# Altium schematic sheet Sync Demod.SchDoc: Sync Demod
size Tabloid; DocumentNumber: LM-003; Revision: 3.0; SheetNumber: 5; SheetTotal: 11
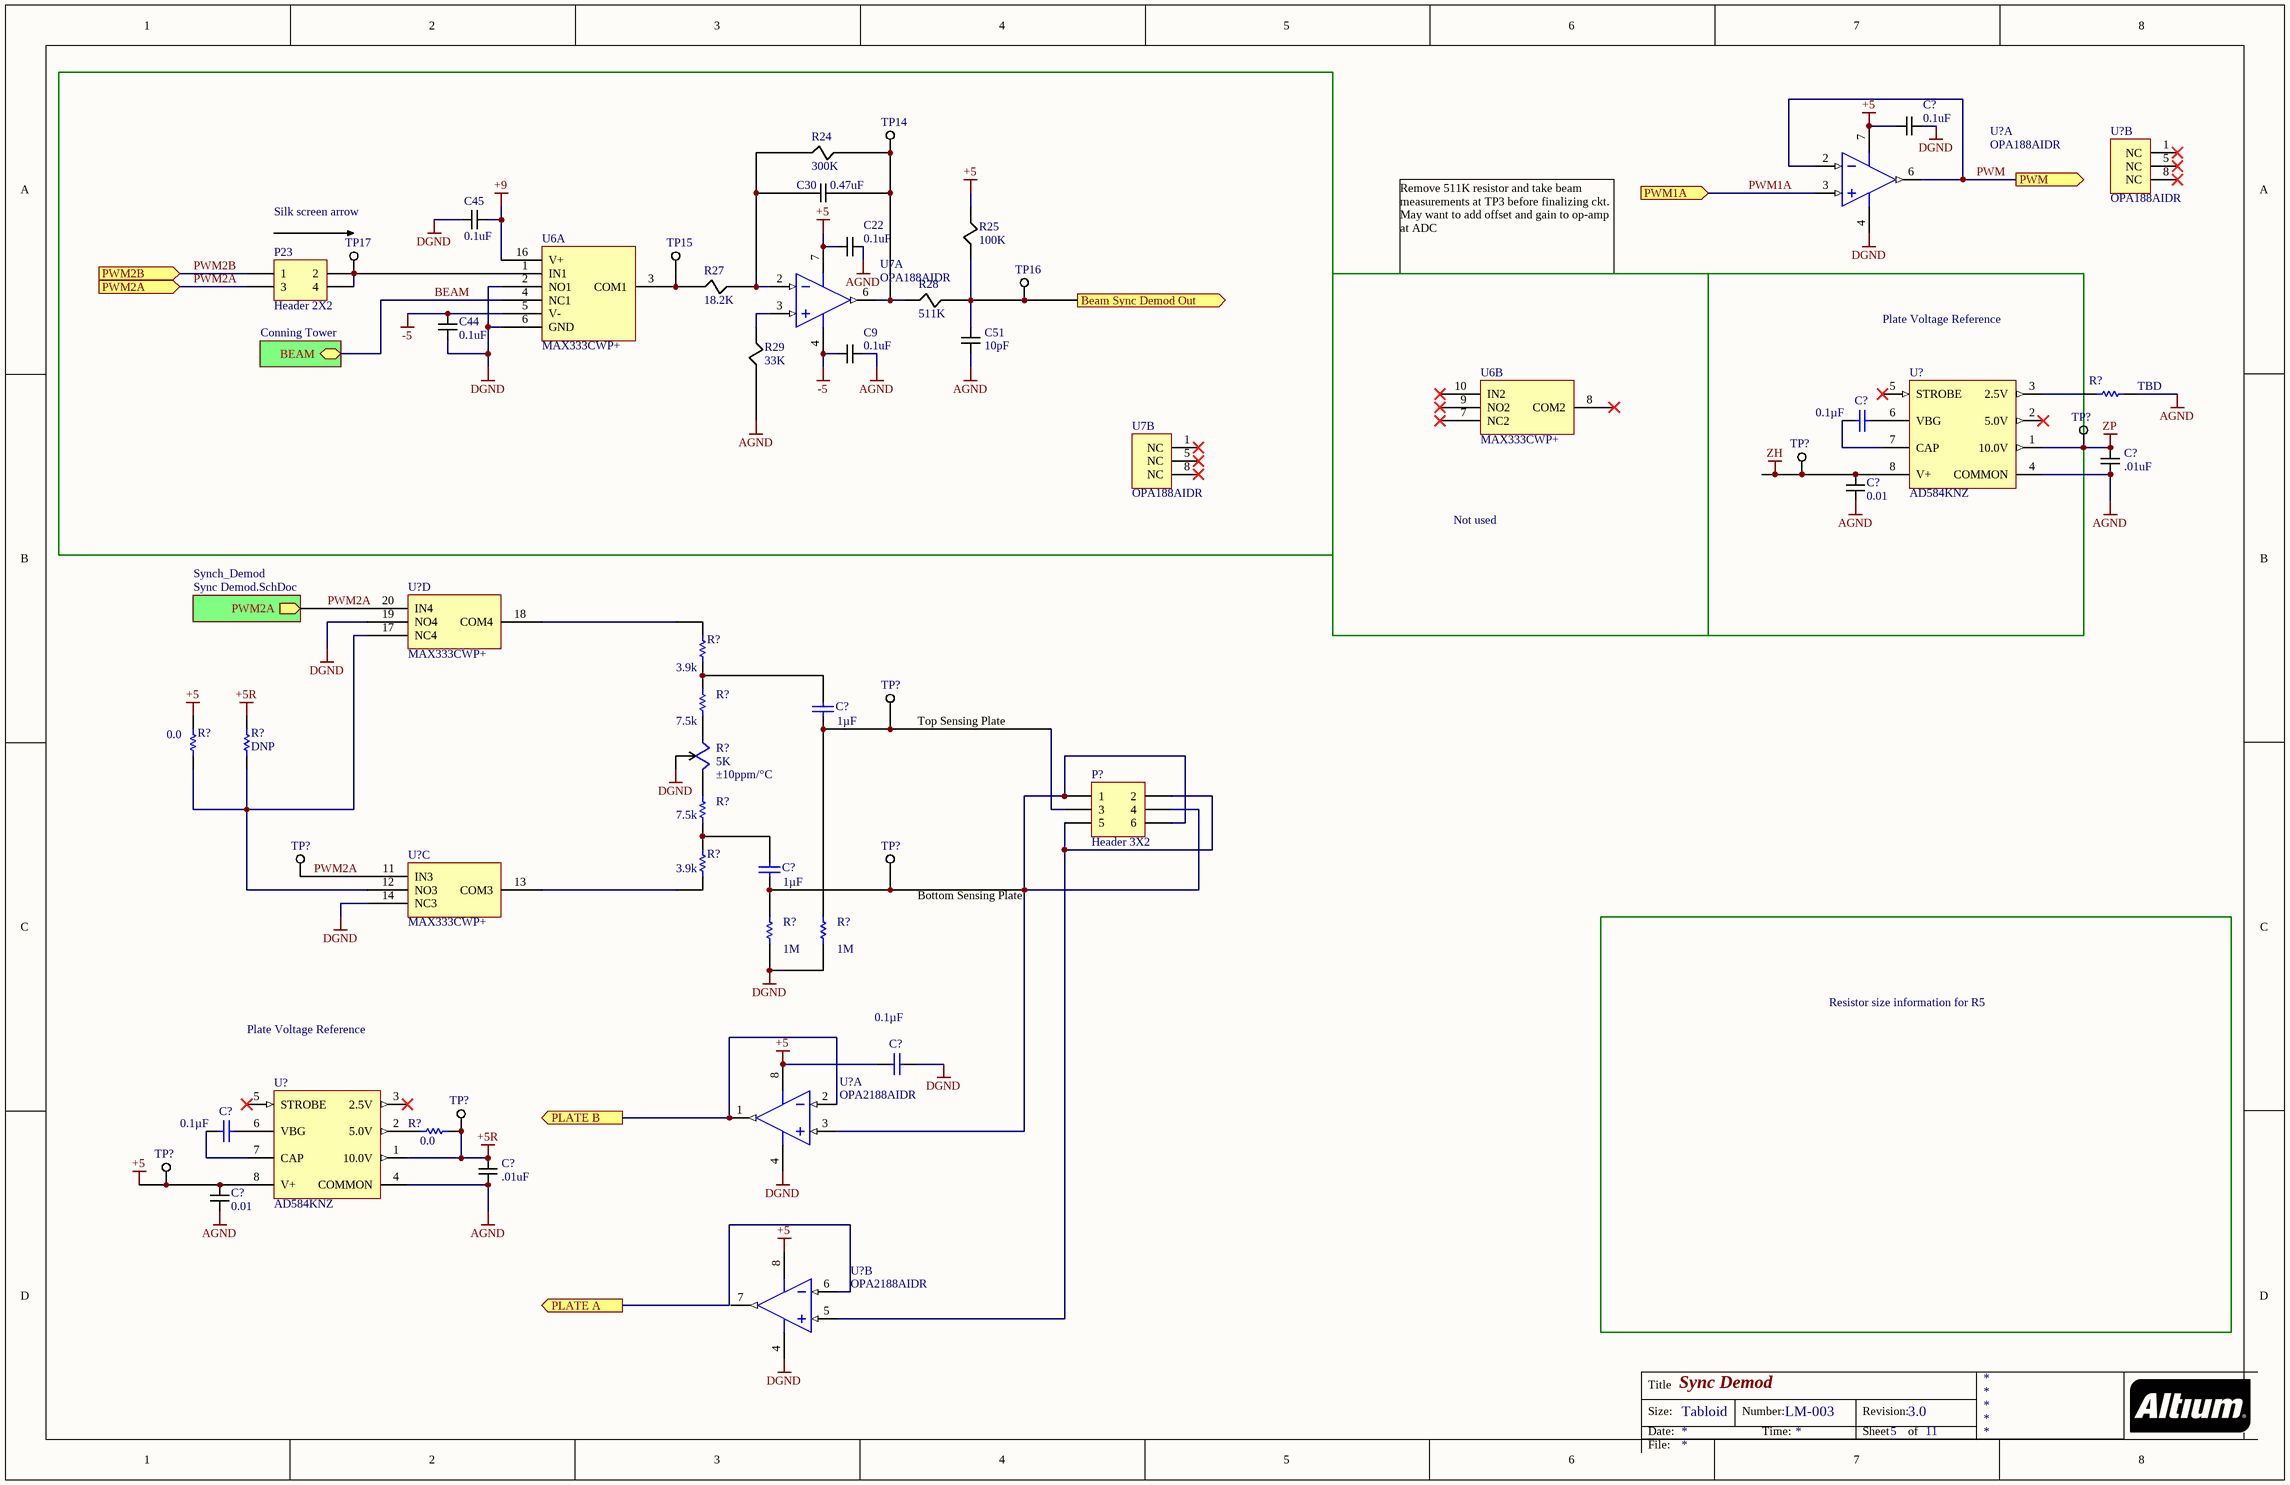
[diagram p0: Sync Demod.SchDoc]

## Parts
(Parts that share a designator on the sheet are numbered #1, #2 ... from top to bottom, then left to right.)
C9  0.1uF
C22  0.1uF
C30  0.47uF
C44  0.1uF
C45  0.1uF
C51  10pF
C?#1  0.1uF
C?#2  Capacitance: 0.1µF  [CAPC0805(2012)100_N]  (hidden comment: CAP 100nF 25V 0805(2012))
C?#3  .01uF
C?#4  0.01  [RAD-0.1]
C?#5  Capacitance: 1µF  [CAPC0805(2012)155_L]  (hidden comment: CAP CER 1UF 25V X7R 0805)
C?#6  Capacitance: 1µF  [CAPC0805(2012)155_L]  (hidden comment: CAP CER 1UF 25V X7R 0805)
C?#7  Capacitance: 0.1µF  [CAPC0805(2012)155_L]  (hidden comment: CAP CER 0.1UF 25V X7R 0805)
C?#8  Capacitance: 0.1µF  [CAPC0805(2012)100_N]  (hidden comment: CAP 100nF 25V 0805(2012))
C?#9  .01uF
C?#10  0.01  [RAD-0.1]
P23  Header 2X2  [HDR2X2]
P?  Header 3X2
R24  300K  [0805]
R25  100K  [0805]
R27  18.2K  [0805]
R28  511K  [0805]
R29  33K  [0805]
R?#1  Resistance (Ohms): TBD  [RESC0805(2012)_L]
R?#2  Resistance (Ohms): 3.9k  [RESC0805(2012)_N]  (hidden comment: RES SMD 3.9K OHM 5% 1/8W 0805)
R?#3  Resistance (Ohms): 7.5k  [RESC0805(2012)_N]  (hidden comment: RES SMD 7.5K OHM 1% 1/8W 0805)
R?#4  5K  Temperature Coefficient: ±10ppm/°C
R?#5  Resistance (Ohms): 0.0  [RESC0805(2012)_M]  (hidden comment: RES SMD 0.0 OHM JUMPER 1/8W 0805)
R?#6  DNP  [RESC0805(2012)_M]
R?#7  Resistance (Ohms): 7.5k  [RESC0805(2012)_N]  (hidden comment: RES SMD 7.5K OHM 1% 1/8W 0805)
R?#8  Resistance (Ohms): 3.9k  [RESC0805(2012)_N]  (hidden comment: RES SMD 3.9K OHM 5% 1/8W 0805)
R?#9  Resistance (Ohms): 1M  [RESC0805(2012)_N]  (hidden comment: RES SMD 1M OHM 1% 1/8W 0805)
R?#10  Resistance (Ohms): 1M  [RESC0805(2012)_N]  (hidden comment: RES SMD 1M OHM 1% 1/8W 0805)
R?#11  Resistance (Ohms): 0.0  [RESC0805(2012)_M]  (hidden comment: RES SMD 0.0 OHM JUMPER 1/8W 0805)
TP14  (no value)
TP15  (no value)
TP16  (no value)
TP17  (no value)
TP?#1  (no value)  [TESTPOINT .45]
TP?#2  (no value)  [TESTPOINT .45]
TP?#3  (no value)
TP?#4  (no value)
TP?#5  (no value)
TP?#6  (no value)  [TESTPOINT .45]
TP?#7  (no value)  [TESTPOINT .45]
U6  MAX333CWP+  (parts A,B of 4)
U7#1  OPA188AIDR  [D0008A_M]  (part A of 2)
U7#2  OPA188AIDR  [D0008A_M]  (part B of 2)
U?#1  OPA188AIDR  [D0008A_M]  (part B of 2)
U?#2  OPA188AIDR  [D0008A_M]  (part A of 2)
U?#3  AD584KNZ  [ADI-N-8]
U?#4  MAX333CWP+  (part D of 4)
U?#5  MAX333CWP+  (part C of 4)
U?#6  AD584KNZ  [ADI-N-8]
U?#7  OPA2188AIDR  [D0008A_L]  (part A of 2)
U?#8  OPA2188AIDR  [D0008A_L]  (part B of 2)

## Blocks framed on the sheet
Silk screen arrow: C9 C22 C30 C44 C45 C51 P23 R24 R25 R27-R29 TP14-TP17 U6 U7#1 U7#2
Not used: U6
Plate Voltage Reference: C?#2 C?#4 TP?#2 U?#3

## Sub-sheets
Conning Tower = Connectors.SchDoc: BEAM
Synch_Demod = Sync Demod.SchDoc: PWM2A (out)

## Ports
Beam Sync Demod Out (out), PLATE A (out), PLATE B (out), PWM1A (in), PWM2A (in), PWM2B (in), PWM (out)

## Nets
+5: C22.1 C?#1.1 C?#7.1 C?#10.1 R25.2 R?#5.2 TP?#7.1 U7#1.7(V+) U?#2.7(V+) U?#6.8(V+) U?#7.8(V+) U?#8.8(V+)
+5R: C?#9.1 R?#6.2 R?#11.1 TP?#6.1 U?#6.1(10.0V)
+9: C45.2 U6.16(V+)
-5: C9.1 C44.1 U6.5(V-) U7#1.4(V-)
AGND: C9.2 C22.2 C51.2 C?#3.2 C?#4.2 C?#9.2 C?#10.2 R29.1 R?#1.2 U?#3.4(COMMON) U?#6.4(COMMON)
DGND: C44.2 C45.1 C?#1.2 C?#7.2 R?#4.3 R?#9.1 R?#10.1 U6.2(NO1) U6.6(GND) U?#2.4(V-) U?#4.19(NO4) U?#5.14(NC3) U?#7.4(V-) U?#8.4(V-)
ZH: C?#4.1 TP?#2.1 U?#3.8(V+)
ZP: C?#3.1 TP?#1.1 U?#3.1(10.0V)
BEAM: U6.4(NC1) ; sheet Conning Tower/BEAM
Beam Sync Demod Out: C51.1 R25.1 R28.2 TP16.1 ; port Beam Sync Demod Out
PLATE A: U?#8.6(IN_B-) ; port PLATE A
PLATE B: U?#7.1(OUT_A) U?#7.2(IN_A-) ; port PLATE B
PWM: U?#2.2(IN-) U?#2.6(OUT) ; port PWM
PWM1A: U?#2.3(IN+) ; port PWM1A
PWM2A: P23.3 TP?#4.1 U?#4.20(IN4) U?#5.11(IN3) ; port PWM2A, sheet Synch_Demod/PWM2A
PWM2B: P23.1 ; port PWM2B
NetC30_1: C30.1 R24.1 R27.2 U7#1.2(IN-)
NetC30_2: C30.2 R24.2 R28.1 TP14.1 U7#1.6(OUT)
NetC?#2_1: C?#2.1 U?#3.7(CAP)
NetC?#2_2: C?#2.2 U?#3.6(VBG)
NetC?#5_1: C?#5.1 P?.3 R?#10.2 TP?#3.1
NetC?#5_2: C?#5.2 R?#2.1 R?#3.2
NetC?#6_1: C?#6.1 P?.1 P?.4 P?.6 R?#9.2 TP?#5.1 U?#7.3(IN_A+)
NetC?#6_2: C?#6.2 R?#7.1 R?#8.2
NetC?#8_1: C?#8.1 U?#6.7(CAP)
NetC?#8_2: C?#8.2 U?#6.6(VBG)
NetP23_2: P23.2 P23.4 TP17.1 U6.1(IN1)
NetP?_2: P?.2 P?.5 U?#8.5(IN_B+)
NetR27_1: R27.1 TP15.1 U6.3(COM1)
NetR29_2: R29.2 U7#1.3(IN+)
NetR?#1_1: R?#1.1 U?#3.3(2.5V)
NetR?#2_2: R?#2.2 U?#4.18(COM4)
NetR?#3_1: R?#3.1 R?#4.1
NetR?#4_2: R?#4.2 R?#7.2
NetR?#5_1: R?#5.1 R?#6.1 U?#4.17(NC4) U?#5.12(NO3)
NetR?#8_1: R?#8.1 U?#5.13(COM3)
NetR?#11_2: R?#11.2 U?#6.2(5.0V)

Not connected (* = marked no-connect by the designer): U6 7(NC2)* 8(COM2)* 9(NO2)* 10(IN2)*; U7#2 1(NC)* 5(NC)* 8(NC)*; U?#1 1(NC)* 5(NC)* 8(NC)*; U?#3 2(5.0V)* 5(STROBE)*; U?#4 15(N/C); U?#6 3(2.5V)* 5(STROBE)*; U?#8 7(OUT_B)

## Notes on the sheet
- Remove 511K resistor and take beam measurements at TP3 before finalizing ckt.
  May want to add offset and gain to op-amp at ADC
- (near TP?#3) Top Sensing Plate
- (near TP?#5) Bottom Sensing Plate
- Plate Voltage Reference
- Resistor size information for R5
- Title
- Size:
- Date:
- Tabloid
- Number:
- Time:
- Revision:
- Sheet
- of
- File:

## Library data of the parts
C9 C22 C44 C45 C?#1 = CAP B: CAP CER 0.1UF 25V X7R 0805; Manufacturer 1: Murata Electronics North America; Manufacturer Part Number 1: GRM21BR71E104KA01L; Category 1: Capacitors; Capacitance: 0.1µF; Tolerance: ±10%; Supplier 1: Digi-Key; Supplier Part Number 1: 490-1673-1-ND; RoHS 1: RoHS Compliant; Description 1: CAP CER 0.1UF 25V X7R 0805; Stock 1: 897437; Pricing 1: 1=0.2, 10=0.145, 25=0.106, 50=0.0824, 100=0.0683, 250=0.05652, 500=0.04788, 1000=0.03964 (USD); Packaging: Cut Tape (CT); Part Status: Active; Voltage - Rated: 25V; Temperature Coefficient: X7R; Operating Temperature: -55°C ~ 125°C; Features: -; Ratings: -; Applications: General Purpose; Mounting Type: Surface Mount, MLCC; Package / Case: 0805 (2012 Metric); Size / Dimension: 0.079" L x 0.049" W (2.00mm x 1.25mm); Height - Seated (Max): -; Thickness (Max): 0.053" (1.35mm); Lead Spacing: -; Lead Style: -; ComponentLink1URL: http://www.murata.com/~/media/webrenewal/support/library/catalog/products/capacitor/mlcc/c02e.ashx; ComponentLink1Description: http://www.murata.com/~/media/webrenewal/support/library/catalog/products/capacitor/mlcc/c02e.ashx
C30 = CAP B: CAP CER 0.47UF 25V X7R 0805; Manufacturer 1: Murata Electronics North America; Manufacturer Part Number 1: GRM219R71E474KA88D; Category 1: Capacitors; Capacitance: 0.47µF; Tolerance: ±10%; Supplier 1: Digi-Key; Supplier Part Number 1: 490-11584-1-ND; RoHS 1: RoHS Compliant; Description 1: CAP CER 0.47UF 25V X7R 0805; Stock 1: 32625; Pricing 1: 1=0.31, 10=0.219, 25=0.1792, 50=0.153, 100=0.1311, 250=0.10924, 500=0.09832, 1000=0.08303 (USD); Packaging: Cut Tape (CT); Part Status: Active; Voltage - Rated: 25V; Temperature Coefficient: X7R; Operating Temperature: -55°C ~ 125°C; Features: -; Ratings: -; Applications: General Purpose; Mounting Type: Surface Mount, MLCC; Package / Case: 0805 (2012 Metric); Size / Dimension: 0.079" L x 0.049" W (2.00mm x 1.25mm); Height - Seated (Max): -; Thickness (Max): 0.037" (0.95mm); Lead Spacing: -; Lead Style: -; ComponentLink1URL: http://www.murata.com/~/media/webrenewal/support/library/catalog/products/capacitor/mlcc/c02e.ashx; ComponentLink1Description: http://www.murata.com/~/media/webrenewal/support/library/catalog/products/capacitor/mlcc/c02e.ashx
C51 = CAP B: CAP CER 10PF 200V C0G/NP0 0805; Manufacturer 1: Murata Electronics North America; Manufacturer Part Number 1: GRM21A5C2D100JW01D; Category 1: Capacitors; Tolerance: ±5%; Temperature Coefficient: C0G, NP0; Supplier 1: Digi-Key; Supplier Part Number 1: 490-14649-1-ND; RoHS 1: RoHS Compliant; Description 1: CAP CER 10PF 200V C0G/NP0 0805; Stock 1: 1350; Pricing 1: 1=0.29, 10=0.196, 25=0.1436, 50=0.1174, 100=0.0991, 250=0.08084, 500=0.06782, 1000=0.05999 (USD); Part Status: Active; Capacitance: 10pF; Voltage - Rated: 200V; Operating Temperature: -55°C ~ 125°C; Features: -; Ratings: -; Applications: General Purpose; Failure Rate: -; Mounting Type: Surface Mount, MLCC; Package / Case: 0805 (2012 Metric); Size / Dimension: 0.079" L x 0.049" W (2.00mm x 1.25mm); Height - Seated (Max): -; Thickness (Max): 0.039" (1.00mm); Lead Spacing: -; Lead Style: -; ComponentLink1URL: http://search.murata.co.jp/Ceramy/image/img/A01X/G101/ENG/GRM21A5C2D100JW01-01.pdf; ComponentLink1Description: http://search.murata.co.jp/Ceramy/image/img/A01X/G101/ENG/GRM21A5C2D100JW01-01.pdf
C?#2 C?#8 = CMP-1036-04416-1: CAP 100nF 25V -20% to +80% 0805 (2012 Metric) Thickness 1mm SMD; Manufacturer: Murata Electronics North America; Manufacturer Part Number: GRM21BR71E104KA01L; Tolerance: ±10%; Temperature Coefficient: X7R; Supplier 1: Digi-Key; Supplier Part Number 1: 490-1673-1-ND; RoHS: RoHS Compliant; Category: Capacitors; Stock 1: 895391; Pricing 1: 1=0.2, 10=0.145, 100=0.0683, 500=0.04788, 1000=0.03964 (USD); Packaging: Cut Tape (CT); Part Status: Active; Voltage - Rated: 25V; Operating Temperature: -55°C ~ 125°C; Features: -; Ratings: -; Applications: General Purpose; Mounting Type: Surface Mount, MLCC; Package / Case: 0805 (2012 Metric); Size / Dimension: 0.079" L x 0.049" W (2.00mm x 1.25mm); Height - Seated (Max): -; Thickness (Max): 0.053" (1.35mm); Lead Spacing: -; Lead Style: -; ComponentLink1URL: http://www.murata.com/~/media/webrenewal/support/library/catalog/products/capacitor/mlcc/c02e.ashx; ComponentLink1Description: http://www.murata.com/~/media/webrenewal/support/library/catalog/products/capacitor/mlcc/c02e.ashx
C?#3 C?#9 = CAP B: CAP CER 10000PF 50V X7R 0805; Manufacturer 1: Murata Electronics North America; Manufacturer Part Number 1: GRM216R71H103KA01D; Category 1: Capacitors; Tolerance: ±10%; Supplier 1: Digi-Key; Supplier Part Number 1: 490-1664-1-ND; RoHS 1: RoHS Compliant; Description 1: CAP CER 10000PF 50V X7R 0805; Stock 1: 1003025; Pricing 1: 1=0.1, 10=0.072, 25=0.052, 50=0.0392, 100=0.032, 250=0.02672, 500=0.02282, 1000=0.01793 (USD); Packaging: Cut Tape (CT); Part Status: Active; Capacitance: 10000pF; Voltage - Rated: 50V; Temperature Coefficient: X7R; Operating Temperature: -55°C ~ 125°C; Features: -; Ratings: -; Applications: General Purpose; Mounting Type: Surface Mount, MLCC; Package / Case: 0805 (2012 Metric); Size / Dimension: 0.079" L x 0.049" W (2.00mm x 1.25mm); Height - Seated (Max): -; Thickness (Max): 0.028" (0.70mm); Lead Spacing: -; Lead Style: -; ComponentLink1URL: http://www.murata.com/~/media/webrenewal/support/library/catalog/products/capacitor/mlcc/c02e.ashx; ComponentLink1Description: http://www.murata.com/~/media/webrenewal/support/library/catalog/products/capacitor/mlcc/c02e.ashx
C?#4 C?#10 = CAP B: CAP CER 10000PF 50V 10% X7R 0402; Manufacturer 1: Murata Electronics North America; Manufacturer Part Number 1: GRM155R71H103KA88D; Category 1: Capacitors; Supplier 1: Digi-Key; Supplier Part Number 1: 490-4516-2-ND; RoHS 1: RoHS Compliant; Description 1: CAP CER 10000PF 50V 10% X7R 0402; Stock 1: 652600; Pricing 1: 10000=0.00372, 20000=0.00354, 30000=0.00336, 50000=0.00301, 100000=0.00243 (USD); Packaging: Tape & Reel (TR); Capacitance: 10000pF; Tolerance: ±10%; Voltage - Rated: 50V; Temperature Coefficient: X7R; Mounting Type: Surface Mount, MLCC; Operating Temperature: -55°C ~ 125°C; Applications: General Purpose; Ratings: -; Package / Case: 0402 (1005 Metric); Size / Dimension: 0.039" L x 0.020" W (1.00mm x 0.50mm); Height - Seated (Max): -; Thickness (Max): 0.022" (0.55mm); Lead Spacing: -; Features: -; Lead Style: -; ComponentLink1URL: http://www.murata.com/products/catalog/pdf/c02e.pdf; ComponentLink1Description: http://www.murata.com/products/catalog/pdf/c02e.pdf
C?#5 C?#6 = CMP-1036-04882-1: Manufacturer: Murata Electronics North America; Manufacturer Part Number: GRM21BR71E105KA99L; Tolerance: ±10%; Supplier 1: Digi-Key; Supplier Part Number 1: 490-6484-6-ND; RoHS: RoHS Compliant; Category: Capacitors; Stock 1: 295074; Pricing 1: 1=0.14, 10=0.099, 100=0.0468, 500=0.0328, 1000=0.02715 (USD); Packaging: Digi-Reel®; Part Status: Active; Voltage - Rated: 25V; Temperature Coefficient: X7R; Operating Temperature: -55°C ~ 125°C; Features: -; Ratings: -; Applications: General Purpose; Mounting Type: Surface Mount, MLCC; Package / Case: 0805 (2012 Metric); Size / Dimension: 0.079" L x 0.049" W (2.00mm x 1.25mm); Height - Seated (Max): -; Thickness (Max): 0.053" (1.35mm); Lead Spacing: -; Lead Style: -; ComponentLink1URL: http://www.murata.com/~/media/webrenewal/support/library/catalog/products/capacitor/mlcc/c02e.ashx; ComponentLink1Description: http://www.murata.com/~/media/webrenewal/support/library/catalog/products/capacitor/mlcc/c02e.ashx
C?#7 = CMP-1036-04882-1: Manufacturer: Murata Electronics North America; Manufacturer Part Number: GRM21BR71E104KA01L; Tolerance: ±10%; Supplier 1: Digi-Key; Supplier Part Number 1: 490-1673-6-ND; RoHS: RoHS Compliant; Category: Capacitors; Stock 1: 891652; Pricing 1: 1=0.2, 10=0.145, 100=0.0683, 500=0.04788, 1000=0.03964 (USD); Packaging: Digi-Reel®; Part Status: Active; Voltage - Rated: 25V; Temperature Coefficient: X7R; Operating Temperature: -55°C ~ 125°C; Features: -; Ratings: -; Applications: General Purpose; Mounting Type: Surface Mount, MLCC; Package / Case: 0805 (2012 Metric); Size / Dimension: 0.079" L x 0.049" W (2.00mm x 1.25mm); Height - Seated (Max): -; Thickness (Max): 0.053" (1.35mm); Lead Spacing: -; Lead Style: -; ComponentLink1URL: http://www.murata.com/~/media/webrenewal/support/library/catalog/products/capacitor/mlcc/c02e.ashx; ComponentLink1Description: http://www.murata.com/~/media/webrenewal/support/library/catalog/products/capacitor/mlcc/c02e.ashx
P23 = Header 2X2: Header, 2-Pin, Dual row; Manufacturer 1: TE Connectivity AMP Connectors; Manufacturer Part Number 1: 1-87215-0; Description 1: CONN HEADER VERT 2POS .100 30AU; Category 1: Connectors, Interconnects; Style: Board to Board or Cable; Shrouding: Unshrouded; Number of Positions: 2; Number of Positions Loaded: All; Row Spacing - Mating: 0.100" (2.54mm); Contact Length - Mating: 0.318" (8.08mm); Contact Length - Post: 0.125" (3.18mm); Overall Contact Length: 0.533" (13.55mm); Material Flammability Rating: UL94 V-0; Current Rating: 3A; Supplier 1: Digi-Key; Supplier Part Number 1: A26564-ND; RoHS 1: RoHS Compliant; Stock 1: 9703; Pricing 1: 1=1.42, 10=1.287, 50=1.1554, 100=1.1029, 250=0.99784, 500=0.91906, 1000=0.78777, 2500=0.73525 (USD); Packaging: Bulk; Part Status: Active; Connector Type: Header; Contact Type: Male Pin; Pitch - Mating: -; Number of Rows: 2; Mounting Type: Through Hole; Termination: Solder; Fastening Type: Push-Pull; Insulation Height: 0.090" (2.29mm); Contact Shape: Circular; Contact Finish - Mating: Gold; Contact Finish Thickness - Mating: 30µin (0.76µm); Contact Finish - Post: Gold; Contact Material: Phosphor Bronze; Insulation Material: Thermoplastic; Features: -; Operating Temperature: -65°C ~ 105°C; Ingress Protection: -; Insulation Color: Black; Voltage Rating: -; Mated Stacking Heights: -; Contact Finish Thickness - Post: Flash; Applications: -; ComponentLink1URL: http://www.te.com/commerce/DocumentDelivery/DDEController?Action=srchrtrv&DocNm=87215&DocType=Customer+Drawing&DocLang=English; ComponentLink1Description: http://www.te.com/commerce/DocumentDelivery/DDEController?Action=srchrtrv&DocNm=87215&DocType=Customer+Drawing&DocLang=English
P? = Header 3X2: Header, 3-Pin, Dual row; Manufacturer 1: Amphenol FCI; Manufacturer Part Number 1: 861400062YO2LF; Description 1: HEADER BERGSTIK; Category 1: Connectors, Interconnects; Pitch - Mating: 0.100" (2.54mm); Style: Board to Board or Cable; Shrouding: Unshrouded; Number of Positions: 6; Number of Positions Loaded: All; Contact Length - Mating: 0.276" (7.00mm); Contact Length - Post: 0.118" (3.00mm); Overall Contact Length: 0.496" (12.60mm); Material Flammability Rating: UL94 V-0; Current Rating: 3A; Voltage Rating: 1000V; Supplier 1: Digi-Key; Supplier Part Number 1: 861400062YO2LF-ND; RoHS 1: RoHS Compliant; Stock 1: 0; Pricing 1: 6000=0.09952 (USD); Packaging: Bulk; Part Status: Active; Connector Type: Header; Contact Type: Male Pin; Number of Rows: 2; Row Spacing - Mating: 0.100" (2.54mm); Mounting Type: Through Hole; Termination: Solder; Fastening Type: -; Insulation Height: 0.102" (2.60mm); Contact Shape: Square; Contact Finish - Mating: Gold or Gold, GXT™; Contact Finish Thickness - Mating: 8µin (0.20µm); Contact Finish - Post: -; Contact Material: Copper Alloy; Insulation Material: Thermoplastic; Features: -; Operating Temperature: -55°C ~ 125°C; Ingress Protection: -; Insulation Color: -; Mated Stacking Heights: -; Contact Finish Thickness - Post: -; Applications: -; ComponentLink1URL: http://portal.fciconnect.com/Comergent//fci/drawing/c-8614-0086.pdf; ComponentLink1Description: http://portal.fciconnect.com/Comergent//fci/drawing/c-8614-0086.pdf
R24 = RES1: RES SMD 300K OHM 1% 1/8W 0805; Manufacturer 1: Vishay Dale; Manufacturer Part Number 1: CRCW0805300KFKEA; Category 1: Resistors; Power (Watts): 0.125W, 1/8W; Temperature Coefficient: ±100ppm/°C; Supplier 1: Digi-Key; Supplier Part Number 1: 541-300KCDKR-ND; RoHS 1: RoHS Compliant; Description 1: RES SMD 300K OHM 1% 1/8W 0805; Stock 1: 30792; Pricing 1: 1=0.1, 10=0.042, 25=0.0304, 50=0.0232, 100=0.017, 250=0.013, 500=0.0104, 1000=0.00765 (USD); Packaging: Digi-Reel®; Part Status: Active; Resistance (Ohms): 300k; Tolerance: ±1%; Composition: Thick Film; Features: Automotive AEC-Q200; Operating Temperature: -55°C ~ 155°C; Package / Case: 0805 (2012 Metric); Supplier Device Package: 0805; Size / Dimension: 0.079" L x 0.049" W (2.00mm x 1.25mm); Height - Seated (Max): 0.020" (0.50mm); Failure Rate: -; ComponentLink1URL: http://www.vishay.com/docs/20035/dcrcwe3.pdf; ComponentLink1Description: http://www.vishay.com/docs/20035/dcrcwe3.pdf
R25 = RES1: RES SMD 100K OHM 1% 1/8W 0805; Manufacturer 1: Vishay Dale; Manufacturer Part Number 1: CRCW0805100KFKEA; Category 1: Resistors; Power (Watts): 0.125W, 1/8W; Temperature Coefficient: ±100ppm/°C; Supplier 1: Digi-Key; Supplier Part Number 1: 541-100KCCT-ND; RoHS 1: RoHS Compliant; Description 1: RES SMD 100K OHM 1% 1/8W 0805; Stock 1: 231934; Pricing 1: 1=0.1, 10=0.042, 25=0.0304, 50=0.0232, 100=0.017, 250=0.013, 500=0.0104, 1000=0.00765 (USD); Packaging: Cut Tape (CT); Part Status: Active; Resistance (Ohms): 100k; Tolerance: ±1%; Composition: Thick Film; Features: Automotive AEC-Q200; Operating Temperature: -55°C ~ 155°C; Package / Case: 0805 (2012 Metric); Supplier Device Package: 0805; Size / Dimension: 0.079" L x 0.049" W (2.00mm x 1.25mm); Height - Seated (Max): 0.020" (0.50mm); Failure Rate: -; ComponentLink1URL: http://www.vishay.com/docs/20035/dcrcwe3.pdf; ComponentLink1Description: http://www.vishay.com/docs/20035/dcrcwe3.pdf
R27 = RES1: RES SMD 18.2K OHM 1% 1/8W 0805; Manufacturer 1: Vishay Dale; Manufacturer Part Number 1: CRCW080518K2FKEA; Category 1: Resistors; Power (Watts): 0.125W, 1/8W; Temperature Coefficient: ±100ppm/°C; Supplier 1: Digi-Key; Supplier Part Number 1: 541-18.2KCCT-ND; RoHS 1: RoHS Compliant; Description 1: RES SMD 18.2K OHM 1% 1/8W 0805; Stock 1: 1350; Pricing 1: 1=0.1, 10=0.042, 25=0.0304, 50=0.0232, 100=0.017, 250=0.013, 500=0.0104, 1000=0.00765 (USD); Packaging: Cut Tape (CT); Part Status: Active; Resistance (Ohms): 18.2k; Tolerance: ±1%; Composition: Thick Film; Features: Automotive AEC-Q200; Operating Temperature: -55°C ~ 155°C; Package / Case: 0805 (2012 Metric); Supplier Device Package: 0805; Size / Dimension: 0.079" L x 0.049" W (2.00mm x 1.25mm); Height - Seated (Max): 0.020" (0.50mm); Failure Rate: -; ComponentLink1URL: http://www.vishay.com/docs/20035/dcrcwe3.pdf; ComponentLink1Description: http://www.vishay.com/docs/20035/dcrcwe3.pdf
R28 = RES1: RES SMD 511K OHM 1% 1/8W 0805; Manufacturer 1: Vishay Dale; Manufacturer Part Number 1: CRCW0805511KFKEA; Category 1: Resistors; Power (Watts): 0.125W, 1/8W; Temperature Coefficient: ±100ppm/°C; Supplier 1: Digi-Key; Supplier Part Number 1: 541-511KCCT-ND; RoHS 1: RoHS Compliant; Description 1: RES SMD 511K OHM 1% 1/8W 0805; Stock 1: 7865; Pricing 1: 1=0.1, 10=0.042, 25=0.0304, 50=0.0232, 100=0.017, 250=0.013, 500=0.0104, 1000=0.00765 (USD); Packaging: Cut Tape (CT); Part Status: Active; Resistance (Ohms): 511k; Tolerance: ±1%; Composition: Thick Film; Features: Automotive AEC-Q200; Operating Temperature: -55°C ~ 155°C; Package / Case: 0805 (2012 Metric); Supplier Device Package: 0805; Size / Dimension: 0.079" L x 0.049" W (2.00mm x 1.25mm); Height - Seated (Max): 0.020" (0.50mm); Failure Rate: -; ComponentLink1URL: http://www.vishay.com/docs/20035/dcrcwe3.pdf; ComponentLink1Description: http://www.vishay.com/docs/20035/dcrcwe3.pdf
R29 = RES1: RES SMD 33K OHM 1% 1/8W 0805; Manufacturer 1: Vishay Dale; Manufacturer Part Number 1: CRCW080533K0FKEA; Category 1: Resistors; Power (Watts): 0.125W, 1/8W; Temperature Coefficient: ±100ppm/°C; Supplier 1: Digi-Key; Supplier Part Number 1: 541-33.0KCDKR-ND; RoHS 1: RoHS Compliant; Description 1: RES SMD 33K OHM 1% 1/8W 0805; Stock 1: 24473; Pricing 1: 1=0.1, 10=0.042, 25=0.0304, 50=0.0232, 100=0.017, 250=0.013, 500=0.0104, 1000=0.00765 (USD); Packaging: Digi-Reel®; Part Status: Active; Resistance (Ohms): 33k; Tolerance: ±1%; Composition: Thick Film; Features: Automotive AEC-Q200; Operating Temperature: -55°C ~ 155°C; Package / Case: 0805 (2012 Metric); Supplier Device Package: 0805; Size / Dimension: 0.079" L x 0.049" W (2.00mm x 1.25mm); Height - Seated (Max): 0.020" (0.50mm); Failure Rate: -; ComponentLink1URL: http://www.vishay.com/docs/20035/dcrcwe3.pdf; ComponentLink1Description: http://www.vishay.com/docs/20035/dcrcwe3.pdf
R?#1 = CMP-1013-00393-1: Manufacturer: Vishay Dale; Tolerance: ±1%; Power (Watts): 0.125W, 1/8W; Temperature Coefficient: ±100ppm/°C; Supplier 1: Digi-Key; Supplier Part Number 1: 541-4.99KCCT-ND; Manufacturer Part Number: TBD; RoHS: RoHS Compliant; Category: Resistors; Stock 1: 93740; Pricing 1: 1=0.1, 10=0.044, 100=0.0178, 1000=0.00802, 2500=0.00696 (USD); Packaging: Cut Tape (CT); Part Status: Active; Composition: Thick Film; Features: Automotive AEC-Q200; Operating Temperature: -55°C ~ 155°C; Package / Case: 0805 (2012 Metric); Supplier Device Package: 0805; Size / Dimension: 0.079" L x 0.049" W (2.00mm x 1.25mm); Height - Seated (Max): 0.020" (0.50mm); Failure Rate: -; ComponentLink1URL: http://www.vishay.com/docs/20035/dcrcwe3.pdf; ComponentLink1Description: http://www.vishay.com/docs/20035/dcrcwe3.pdf
R?#2 R?#8 = CMP-1013-00606-1: Manufacturer: Vishay Dale; Manufacturer Part Number: CRCW08053K90JNEA; Power (Watts): 0.125W, 1/8W; Temperature Coefficient: ±200ppm/°C; Supplier 1: Digi-Key; Supplier Part Number 1: 541-3.9KADKR-ND; RoHS: RoHS Compliant; Category: Resistors; Stock 1: 20963; Pricing 1: 1=0.1, 10=0.028, 100=0.0114, 1000=0.00513, 2500=0.00445 (USD); Packaging: Digi-Reel®; Part Status: Active; Tolerance: ±5%; Composition: Thick Film; Features: Automotive AEC-Q200; Operating Temperature: -55°C ~ 155°C; Package / Case: 0805 (2012 Metric); Supplier Device Package: 0805; Size / Dimension: 0.079" L x 0.049" W (2.00mm x 1.25mm); Height - Seated (Max): 0.020" (0.50mm); Failure Rate: -; ComponentLink1URL: http://www.vishay.com/docs/20035/dcrcwe3.pdf; ComponentLink1Description: http://www.vishay.com/docs/20035/dcrcwe3.pdf
R?#3 R?#7 = CMP-1013-00606-1: Manufacturer: Vishay Dale; Manufacturer Part Number: CRCW08057K50FKEA; Power (Watts): 0.125W, 1/8W; Temperature Coefficient: ±100ppm/°C; Supplier 1: Digi-Key; Supplier Part Number 1: 541-7.50KCDKR-ND; RoHS: RoHS Compliant; Category: Resistors; Stock 1: 0; Pricing 1: 1=0.1, 10=0.044, 100=0.0178, 1000=0.00802, 2500=0.00696 (USD); Packaging: Digi-Reel®; Part Status: Active; Tolerance: ±1%; Composition: Thick Film; Features: Automotive AEC-Q200; Operating Temperature: -55°C ~ 155°C; Package / Case: 0805 (2012 Metric); Supplier Device Package: 0805; Size / Dimension: 0.079" L x 0.049" W (2.00mm x 1.25mm); Height - Seated (Max): 0.020" (0.50mm); Failure Rate: -; ComponentLink1URL: http://www.vishay.com/docs/20035/dcrcwe3.pdf; ComponentLink1Description: http://www.vishay.com/docs/20035/dcrcwe3.pdf
R?#4 = RES1, CENTER TAP: TRIMMER 5K OHM 0.25W PC PIN; Manufacturer 1: Vishay Foil Resistors (Division of Vishay Precision Group); Manufacturer Part Number 1: Y00535K00000J0L; Category 1: Potentiometers, Variable Resistors; Power (Watts): 0.25W, 1/4W; Tolerance: ±5%; Number of Turns: 21; Adjustment Type: Side Adjustment; Resistive Material: Metal Foil; Supplier 1: Digi-Key; Supplier Part Number 1: 804-1020-ND; RoHS 1: RoHS Compliant; Description 1: TRIMMER 5K OHM 0.25W PC PIN; Stock 1: 679; Pricing 1: 1=34.42, 10=32.265, 25=26.5292, 50=22.944, 100=22.227, 250=20.793, 500=19.2156 (USD); Packaging: Bulk; Part Status: Active; Resistance (Ohms): 5k; Mounting Type: Through Hole; Termination Style: PC Pins; Size / Dimension: Rectangular - 0.250" x 0.175" Face x 0.250" L (6.35mm x 4.45mm x 6.35mm); ComponentLink1URL: http://www.vishaypg.com/docs/63053/1240.pdf; ComponentLink1Description: http://www.vishaypg.com/docs/63053/1240.pdf
R?#5 R?#11 = CMP-1013-00017-1: Manufacturer: Vishay Dale; Manufacturer Part Number: CRCW08050000Z0EA; Power (Watts): 0.125W, 1/8W; Supplier 1: Digi-Key; Supplier Part Number 1: 541-0.0ADKR-ND; RoHS: RoHS Compliant; Category: Resistors; Stock 1: 407603; Pricing 1: 1=0.1, 10=0.026, 25=0.0184, 50=0.014, 100=0.0104, 250=0.00792, 500=0.00634, 1000=0.00466 (USD); Packaging: Digi-Reel®; Part Status: Active; Tolerance: Jumper; Composition: Thick Film; Features: Automotive AEC-Q200; Temperature Coefficient: -; Operating Temperature: -55°C ~ 155°C; Package / Case: 0805 (2012 Metric); Supplier Device Package: 0805; Size / Dimension: 0.079" L x 0.049" W (2.00mm x 1.25mm); Height - Seated (Max): 0.020" (0.50mm); Failure Rate: -; ComponentLink1URL: http://www.vishay.com/docs/20035/dcrcwe3.pdf; ComponentLink1Description: http://www.vishay.com/docs/20035/dcrcwe3.pdf
R?#6 = CMP-1013-00017-1: RES SMD 0.0 OHM JUMPER 1/8W 0805; Manufacturer: Vishay Dale; Manufacturer Part Number: CRCW08050000Z0EA; Resistance (Ohms): 0.0; Power (Watts): 0.125W, 1/8W; Supplier 1: Digi-Key; Supplier Part Number 1: 541-0.0ADKR-ND; RoHS: RoHS Compliant; Category: Resistors; Stock 1: 407603; Pricing 1: 1=0.1, 10=0.026, 25=0.0184, 50=0.014, 100=0.0104, 250=0.00792, 500=0.00634, 1000=0.00466 (USD); Packaging: Digi-Reel®; Part Status: Active; Tolerance: Jumper; Composition: Thick Film; Features: Automotive AEC-Q200; Temperature Coefficient: -; Operating Temperature: -55°C ~ 155°C; Package / Case: 0805 (2012 Metric); Supplier Device Package: 0805; Size / Dimension: 0.079" L x 0.049" W (2.00mm x 1.25mm); Height - Seated (Max): 0.020" (0.50mm); Failure Rate: -; ComponentLink1URL: http://www.vishay.com/docs/20035/dcrcwe3.pdf; ComponentLink1Description: http://www.vishay.com/docs/20035/dcrcwe3.pdf
R?#9 R?#10 = CMP-1013-00606-1: Manufacturer: Vishay Dale; Manufacturer Part Number: CRCW08051M00FKEA; Power (Watts): 0.125W, 1/8W; Temperature Coefficient: ±100ppm/°C; Supplier 1: Digi-Key; Supplier Part Number 1: 541-1.00MCDKR-ND; RoHS: RoHS Compliant; Category: Resistors; Stock 1: 44065; Pricing 1: 1=0.1, 10=0.044, 100=0.0178, 1000=0.00802, 2500=0.00696 (USD); Packaging: Digi-Reel®; Part Status: Active; Tolerance: ±1%; Composition: Thick Film; Features: Automotive AEC-Q200; Operating Temperature: -55°C ~ 155°C; Package / Case: 0805 (2012 Metric); Supplier Device Package: 0805; Size / Dimension: 0.079" L x 0.049" W (2.00mm x 1.25mm); Height - Seated (Max): 0.020" (0.50mm); Failure Rate: -; ComponentLink1URL: http://www.vishay.com/docs/20035/dcrcwe3.pdf; ComponentLink1Description: http://www.vishay.com/docs/20035/dcrcwe3.pdf
TP14-TP17 TP?#3-TP?#5 = TESTPOINT A: TEST POINT PC MINI .040"D BLACK; Manufacturer 1: Keystone Electronics; Manufacturer Part Number 1: 5001; Category 1: Test and Measurement; Plating: Silver; Material - Insulation: Nylon 46, UL 94V-0; Material - Body: Phosphor Bronze; Supplier 1: Digi-Key; Supplier Part Number 1: 36-5001-ND; RoHS 1: RoHS Compliant; Description 1: TEST POINT PC MINI .040"D BLACK; Stock 1: 883882; Pricing 1: 1=0.37, 10=0.316, 50=0.2298, 100=0.2209, 250=0.19832, 500=0.18932, 1000=0.1616, 2500=0.14424, 5000=0.13523 (USD); Packaging: Bulk; Part Status: Active; Type: PC Test Point, Miniature; Mounting Type: 0.040" (1.02mm) Hole Diameter; Color: Black; Size / Dimension: 0.100" Dia x 0.180" L (2.54mm x 4.57mm); Height: -; ComponentLink1URL: http://www.keyelco.com/product-pdf.cfm?p=1310; ComponentLink1Description: http://www.keyelco.com/product-pdf.cfm?p=1310
TP?#1 TP?#2 TP?#6 TP?#7 = TESTPOINT A
U7#1 U7#2 U?#1 U?#2 = CMP-0809-00004-2: Precision, Low Noise, Rail-to-Rail Output, Zero-Drift Operational Amplifier, 4 to 36 V, -40 to 125 degC, 8-pin SOIC (D8), Green (RoHS & no Sb/Br); Manufacturer: Texas Instruments; Iq per channel(Max)(mA): 0.51; SubFamily: Zero Drift Precision Amplifier; Total Supply Voltage(Max)(+5V is 5, +/-5V is 10): 36; CMRR(Min)(dB): 120; Total Supply Voltage(Min)(+5V is 5, +/-5V is 10): 4; Slew Rate(Typ)(V/us): 0.8; GBW(Typ)(MHz): 2; Offset Drift(Typ)(uV/C): 0.03; Number of Channels: 1; Rating: Catalog; Packing: LARGE T&R; ComponentLink2URL: http://www.ti.com/lit/ds/symlink/opa188.pdf; Eco-Plan: Green (RoHS & no Sb/Br); DatasheetVersion: SBOS642A; PartNumber: OPA188AIDR; ComponentLink3Description: Package Specification; PackageDescription: 8-Pin Plastic Small Outline, Body 4.9 x 3.9 mm, Pitch 1.27 mm; Code_JEDEC: MS-012; ComponentLink1Description: Manufacturer URL; PackageReference: D0008A; Mounting Technology: Surface Mount; PackageVersion: 4040047-3/M, 06/2011; ComponentLink3URL: http://www.ti.com/litv/pdf/msoi002j; ComponentLink2Description: Datasheet; ComponentLink1URL: http://www.ti.com/; PartId: 1
U?#3 U?#6 = CMP-0784-00054-1: Pin Programmable, Precision Voltage Reference, + 2.5 / + 5 / + 7.5 / + 10 Prog V Output, 4.5 to 30 V Supply, Commercial, 8-pin DIP (N-8), Tube; Manufacturer: Analog Devices; Max V Supply (V): 30; Min V Supply (V): 4.5; Ref Out TC (ppm/C): 15; Vout: 2.5V, 5V, 7.5V, 10V; ComponentLink3URL: http:/www.analog.com/static/imported-files/packages/PKG_PDF/PDIP(N)/N_8.pdf; ComponentLink1URL: http://www.analog.com/en/index.html; PartNumber: AD584KNZ; ComponentLink1Description: Manufacturer URL; ComponentLink2Description: Datasheet; PackageDescription: 8-Pin Plastic Dual In-Line Package, Row spacing 7.62 mm, Pitch 2.54 mm; Operating Temp Range: 0 to 70 degC; DatasheetVersion: Rev. C; Code_JEDEC: MS-001; Packing: Tube; ComponentLink3Description: Package Specification; PackageReference: N-8; ComponentLink4Description: URL Link1; Mounting Technology: Through Hole; PackageVersion: 070606-A, 07/2006; ComponentLink4URL: Product URL:http://www.analog.com/en/special-linear-functions/voltage-references/ad584/products/product.html; ComponentLink2URL: http://www.analog.com/static/imported-files/data_sheets/AD584.pdf
U?#7 U?#8 = CMP-0272-00241-3: 0.03 uV/degC, 6 uV Vos, Low Noise, Rail-to-Rail Output, Zero-Drift Operational Amplifier, 4 to 36 V, -40 to 105 degC, 8-pin SOIC (D8), Green (RoHS & no Sb/Br); Manufacturer: Texas Instruments; Number of Circuits: 2; Slew Rate: 0.8 V/µs; Current - Supply: 415µA; Current - Output / Channel: 18mA; Voltage - Supply, Single/Dual (±): 4 V ~ 36 V, ±2 V ~ 18 V; Supplier 1: Digi-Key; Supplier Part Number 1: 296-29454-6-ND; Manufacturer Part Number: OPA2188AIDR; RoHS: RoHS Compliant; Category: Integrated Circuits (ICs); Stock 1: 8272; Pricing 1: 1=3.44, 10=3.089, 100=2.5307, 500=2.15434, 1000=1.81692 (USD); Packaging: Digi-Reel®; Part Status: Active; Amplifier Type: Zero-Drift; Output Type: Rail-to-Rail; -3db Bandwidth: -; Operating Temperature: -40°C ~ 105°C; Mounting Type: Surface Mount; Package / Case: 8-SOIC (0.154", 3.90mm Width); Supplier Device Package: 8-SOIC; ComponentLink1URL: http://www.ti.com/lit/ds/symlink/opa2188.pdf; ComponentLink1Description: http://www.ti.com/lit/ds/symlink/opa2188.pdf